# Altium schematic sheet Motor_Drivers.SchDoc
size A3; Address1: ECE Department; Address2: University of Canterbury; Address3: Christchurch 8041; Address4: New Zealand; Revision: 1
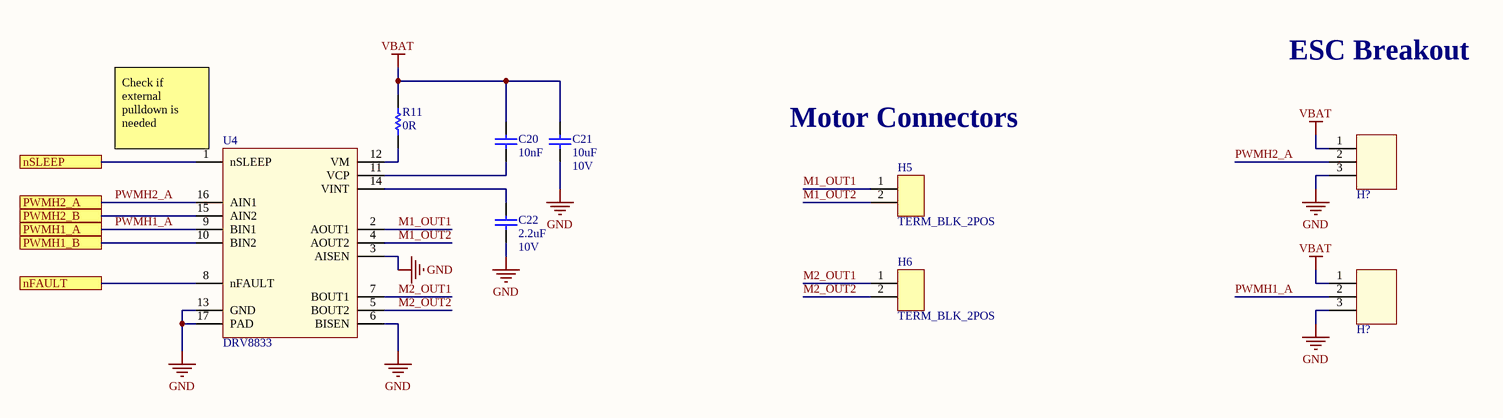
[diagram p0: Motor_Drivers.SchDoc]

## Parts
(Parts that share a designator on the sheet are numbered #1, #2 ... from top to bottom, then left to right.)
C20  10nF  [CAPC1608L]
C21  Max Voltage: 10V  [CAPC2012L]  (hidden comment: 10uF)
C22  Max Voltage: 10V  [CAPC1608L]  (hidden comment: 2.2uF)
H5  TERM_BLK_2POS  [TERM_BLK_2POS]
H6  TERM_BLK_2POS  [TERM_BLK_2POS]
H?#1  HEADER_3  [HEADER_3POS]  (value not drawn)
H?#2  HEADER_3  [HEADER_3POS]  (value not drawn)
R11  0R  [RESC1608L]
U4  DRV8833  [HTSOP16]

## Ports
nFAULT, nSLEEP, PWMH1_A, PWMH1_B, PWMH2_A, PWMH2_B

## Nets
GND: C21.1 C22.1 H?#1.3 H?#2.3 U4.3(AISEN) U4.6(BISEN) U4.13(GND) U4.17(PAD)
VBAT: C20.2 C21.2 H?#1.1 H?#2.1 R11.2
M1_OUT1: H5.1 U4.2(AOUT1)
M1_OUT2: H5.2 U4.4(AOUT2)
M2_OUT1: H6.1 U4.7(BOUT1)
M2_OUT2: H6.2 U4.5(BOUT2)
nFAULT: U4.8(nFAULT) ; port nFAULT
nSLEEP: U4.1(nSLEEP) ; port nSLEEP
PWMH1_A: H?#2.2 U4.9(BIN1) ; port PWMH1_A
PWMH1_B: U4.10(BIN2) ; port PWMH1_B
PWMH2_A: H?#1.2 U4.16(AIN1) ; port PWMH2_A
PWMH2_B: U4.15(AIN2) ; port PWMH2_B
NetC20_1: C20.1 U4.11(VCP)
NetC22_2: C22.2 U4.14(VINT)
NetR11_1: R11.1 U4.12(VM)

## Notes on the sheet
- ESC Breakout
- (near U4) Check if external pulldown is needed
- Motor Connectors
- Title
- Drawn by:
- Date:
- Time:
- Revision:
- Sheet
- of
- File:

## Library data of the parts
C20 = CC_10nF_0603: CAP CER 10nF X7R +-10% 50V 0603; PackageReference: 0603; Code_IPC: 1608 [0603]; Verify: *; Supplier: ECE Dept; Storage Location: PCB Assembly WS; Value: 10nF
C21 = CC_10uF_0805_10V: CAP CER 10uF X7R +-20% 10V 0805; Note: Footprint corresponds to dimensions for bulk cassette packaging. This case size has tightened tolerances.; PackageReference: 0805; Code_IPC: 2012[0805]; Verify: *; Supplier: ECE Dept; Storage Location: PCB Assembly WS; Value: 10uF
C22 = CC_2.2uF_0603: CAP CER 2.2uF X5R +-20% 10V 0603; PackageReference: 0603; Code_IPC: 1608 [0603]; Verify: *; Supplier: ECE Dept; Storage Location: PCB Assembly WS; Value: 2.2uF
H5 H6 = TERM_BLK_2POS: 2 Position Terminal Block 7.62mm spacing
H?#1 H?#2 = HEADER_3: 3Pin Header 2.54mm spacing
R11 = RS_0R0: RES 0.0 OHM 1/10W 5% 0603 SMD; Storage Location: PCB Assembly WS; Supplier: ECE Dept; Value: 0R
U4 = DRV8833: Dual H-Bridge Motor Driver 1.5A